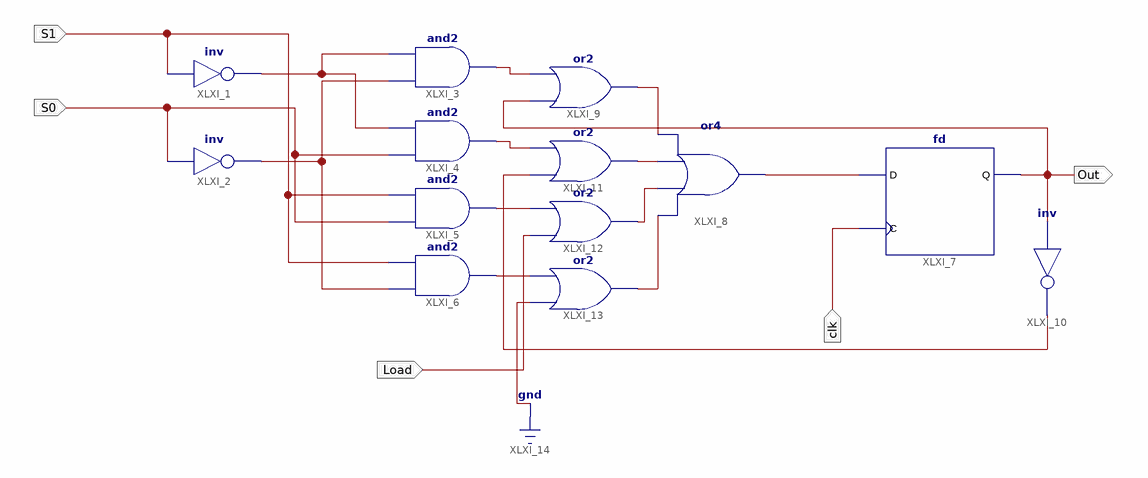
[diagram p0: schematic sheet 1]
// Xilinx ISE schematic C6_17_0.sch (kintex7) as structural Verilog: 13 symbols, 5 ports
module C6_17_0 (
  input  S1,
  input  S0,
  input  Load,
  input  clk,
  output Out
);

  wire XLXN_5, XLXN_6, XLXN_14, XLXN_15, XLXN_17, XLXN_18, XLXN_19, XLXN_20, XLXN_22, XLXN_23, XLXN_24,
       XLXN_25;

  not XLXI_1 (XLXN_5, S1);
  not XLXI_2 (XLXN_6, S0);
  and XLXI_3 (XLXN_15, XLXN_6, XLXN_5);
  and XLXI_4 (XLXN_19, S0, XLXN_5);
  and XLXI_5 (XLXN_20, S0, S1);
  and XLXI_6 (XLXN_22, XLXN_6, S1);
  fd XLXI_7 (.C(clk), .D(XLXN_14), .Q(Out));
  or XLXI_8 (XLXN_14, XLXN_23, XLXN_24, XLXN_25, XLXN_17);
  or XLXI_9 (XLXN_17, Out, XLXN_15);
  not XLXI_10 (XLXN_18, Out);
  or XLXI_11 (XLXN_25, XLXN_18, XLXN_19);
  or XLXI_12 (XLXN_24, Load, XLXN_20);
  or XLXI_13 (XLXN_23, 1'b0, XLXN_22);
endmodule
